# EAGLE design relay_controller (EAGLE 7.6.0)

## Sheet 1 of 2
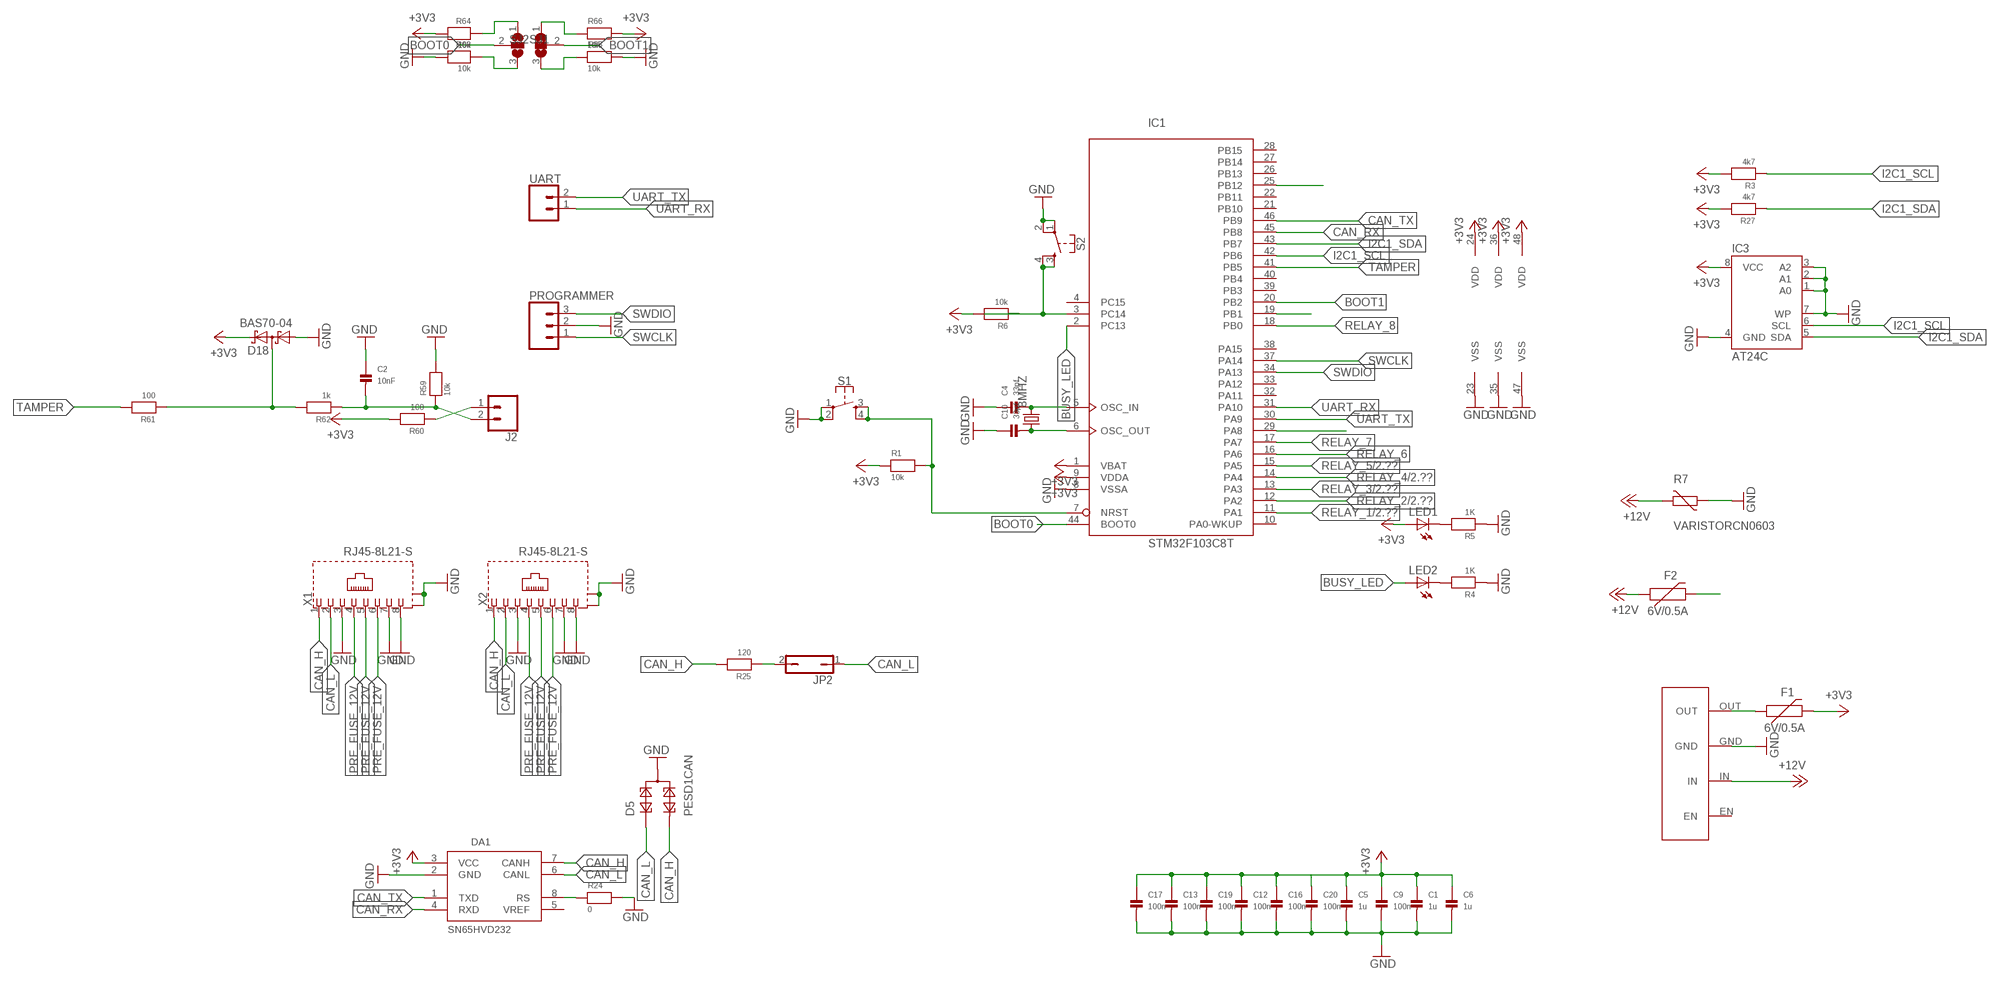
[diagram p0: schematic, sheet 1]

### Parts
8MHZ  CRYSTALHC49UP  [HC49UP]
C1  1u  CAP_CERAMIC0603  [0603]
C2  10nF  CAP_CERAMIC0603  [0603]
C4  33pf  CAP_CERAMIC0603  [0603]
C5  1u  CAP_CERAMIC0603  [0603]
C6  1u  CAP_CERAMIC0603  [0603]
C9  100n  CAP_CERAMIC0603  [0603]
C10  33pf  CAP_CERAMIC0603  [0603]
C12  100n  CAP_CERAMIC0603  [0603]
C13  100n  CAP_CERAMIC0603  [0603]
C16  100n  CAP_CERAMIC0603  [0603]
C17  100n  CAP_CERAMIC0603  [0603]
C19  100n  CAP_CERAMIC0603  [0603]
C20  100n  CAP_CERAMIC0603  [0603]
D5  PESD1CAN  [SOT23]
D18  BAS70-04  [SOT23]
DA1  SN65HVD232  [SO08]
F1  6V/0.5A  PPTC_HALF-AMP  [1206]
F2  6V/0.5A  PPTC_HALF-AMP  [1206]
IC1  STM32F103C8T  [LQFP48]
IC3  AT24C  [SOIC8]
J2  CONN_023.5MM  [SCREWTERMINAL-3.5MM-2]
JP2  JP1Q  [JP1]
LED1  LEDCHIPLED_0805  [CHIPLED_0805]
LED2  LEDCHIPLED_0805  [CHIPLED_0805]
PROGRAMMER  CONN_03LOCK  [1X03_LOCK]
R1  10k  RESISTOR0603  [0603]
R3  4k7  RESISTOR0603  [0603]
R4  1K  RESISTOR0603  [0603]
R5  1K  RESISTOR0603  [0603]
R6  10k  RESISTOR0603  [0603]
R7  VARISTORCN0603  [CT/CN0603]
R24  0  RESISTOR0603  [0603]
R25  120  RESISTOR0603  [0603]
R27  4k7  RESISTOR0603  [0603]
R59  10k  RESISTOR0603  [0603]
R60  100  RESISTOR0603  [0603]
R61  100  RESISTOR0603  [0603]
R62  1k  RESISTOR0603  [0603]
R63  10k  RESISTOR0603  [0603]
R64  10k  RESISTOR0603  [0603]
R65  10k  RESISTOR0603  [0603]
R66  10k  RESISTOR0603  [0603]
S1  MOMENTARY-SWITCH-SPST-2-SMD-4.6X2.8MM  [TACTILE_SWITCH_SMD_4.6X2.8MM]
S2  MOMENTARY-SWITCH-SPST-2-SMD-4.6X2.8MM  [TACTILE_SWITCH_SMD_4.6X2.8MM]
SJ1  SJ2W  [SJ_2]
SJ2  SJ2W  [SJ_2]
U$1  HW-613  [HW-613]
UART  CONN_02  [1X02]
X1  RJ45-8L21-S  [RJ45-SHIELD1]
X2  RJ45-8L21-S  [RJ45-SHIELD1]

### Nets
+3V3: C1.1 C5.1 C6.1 C9.1 C12.1 C13.1 C16.1 C17.1 C19.1 C20.1 D18.2(C2) DA1.3(VCC) F1.2 IC1.1(VBAT) IC1.9(VDDA) IC1.24(VDD) IC1.36(VDD) IC1.48(VDD) IC3.8(VCC) LED1.A R1.1 R3.2 R6.2 R27.2 R60.2 R64.2 R66.2
+12V: F2.1 R7.2 U$1.IN ; also sheet 2
ASDASD: D18.3(C1A2) R61.1 R62.2
BOOT0: IC1.44(BOOT0) SJ1.2
BOOT1: IC1.20(PB2) SJ2.2
BUSY_LED: IC1.2(PC13) LED2.A
CAN_H: D5.2 DA1.7(CANH) R25.2 X1.1 X2.1
CAN_L: D5.1 DA1.6(CANL) JP2.1 X1.2 X2.2
CAN_RX: DA1.4(RXD) IC1.45(PB8)
CAN_TX: DA1.1(TXD) IC1.46(PB9)
GND: C1.2 C2.1 C4.1 C5.2 C6.2 C9.2 C10.1 C12.2 C13.2 C16.2 C17.2 C19.2 C20.2 D5.3 D18.1(A1) DA1.2(GND) IC1.8(VSSA) IC1.23(VSS) IC1.35(VSS) IC1.47(VSS) IC3.1(A0) IC3.2(A1) IC3.3(A2) IC3.4(GND) IC3.7(WP) PROGRAMMER.2 R4.1 R5.1 R7.1 R24.2 R59.2 R63.2 R65.2 S1.1 S1.2 S2.1 S2.2 U$1.GND X1.3 X1.7 X1.8 X1.S1(S) X1.S2(S) X2.3 X2.7 X2.8 X2.S1(S) X2.S2(S) ; also sheet 2
I2C1_SCL: IC1.42(PB6) IC3.6(SCL) R3.1
I2C1_SDA: IC1.43(PB7) IC3.5(SDA) R27.1
N$1: 8MHZ.2 C4.2 IC1.5(OSC_IN)
N$2: 8MHZ.1 C10.2 IC1.6(OSC_OUT)
N$3: F1.1 U$1.OUT
N$5: C2.2 J2.2 R59.1 R62.1
N$6: LED1.C R5.2
N$7: IC1.3(PC14) R6.1 S2.3 S2.4
N$8: LED2.C R4.2
N$10: J2.1 R60.1
N$11: IC1.7(NRST) R1.2 S1.3 S1.4
N$12: JP2.2 R25.1
N$17: DA1.8(RS) R24.1
N$29: R66.1 SJ2.1
N$30: R64.1 SJ1.1
N$31: R65.1 SJ2.3
N$32: R63.1 SJ1.3
PRE_FUSE_12V: F2.2 X1.4 X1.5 X1.6 X2.4 X2.5 X2.6
RELAY_1: IC1.11(PA1) ; also sheet 2
RELAY_2: IC1.12(PA2) ; also sheet 2
RELAY_3: IC1.13(PA3) ; also sheet 2
RELAY_4: IC1.14(PA4) ; also sheet 2
RELAY_5: IC1.15(PA5) ; also sheet 2
RELAY_6: IC1.16(PA6)
RELAY_7: IC1.17(PA7)
RELAY_8: IC1.18(PB0)
RELAY_9: IC1.19(PB1)
RELAY_12: IC1.25(PB12)
RELAY_16: IC1.29(PA8)
SWCLK: IC1.37(PA14) PROGRAMMER.1
SWDIO: IC1.34(PA13) PROGRAMMER.3
TAMPER: IC1.41(PB5) R61.2
UART_RX: IC1.31(PA10) UART.1
UART_TX: IC1.30(PA9) UART.2
Unconnected: DA1.5(VREF) IC1.4(PC15) IC1.10(PA0-WKUP) IC1.21(PB10) IC1.22(PB11) IC1.26(PB13) IC1.27(PB14) IC1.28(PB15) IC1.32(PA11) IC1.33(PA12) IC1.38(PA15) IC1.39(PB3) IC1.40(PB4) U$1.EN

## Sheet 2 of 2
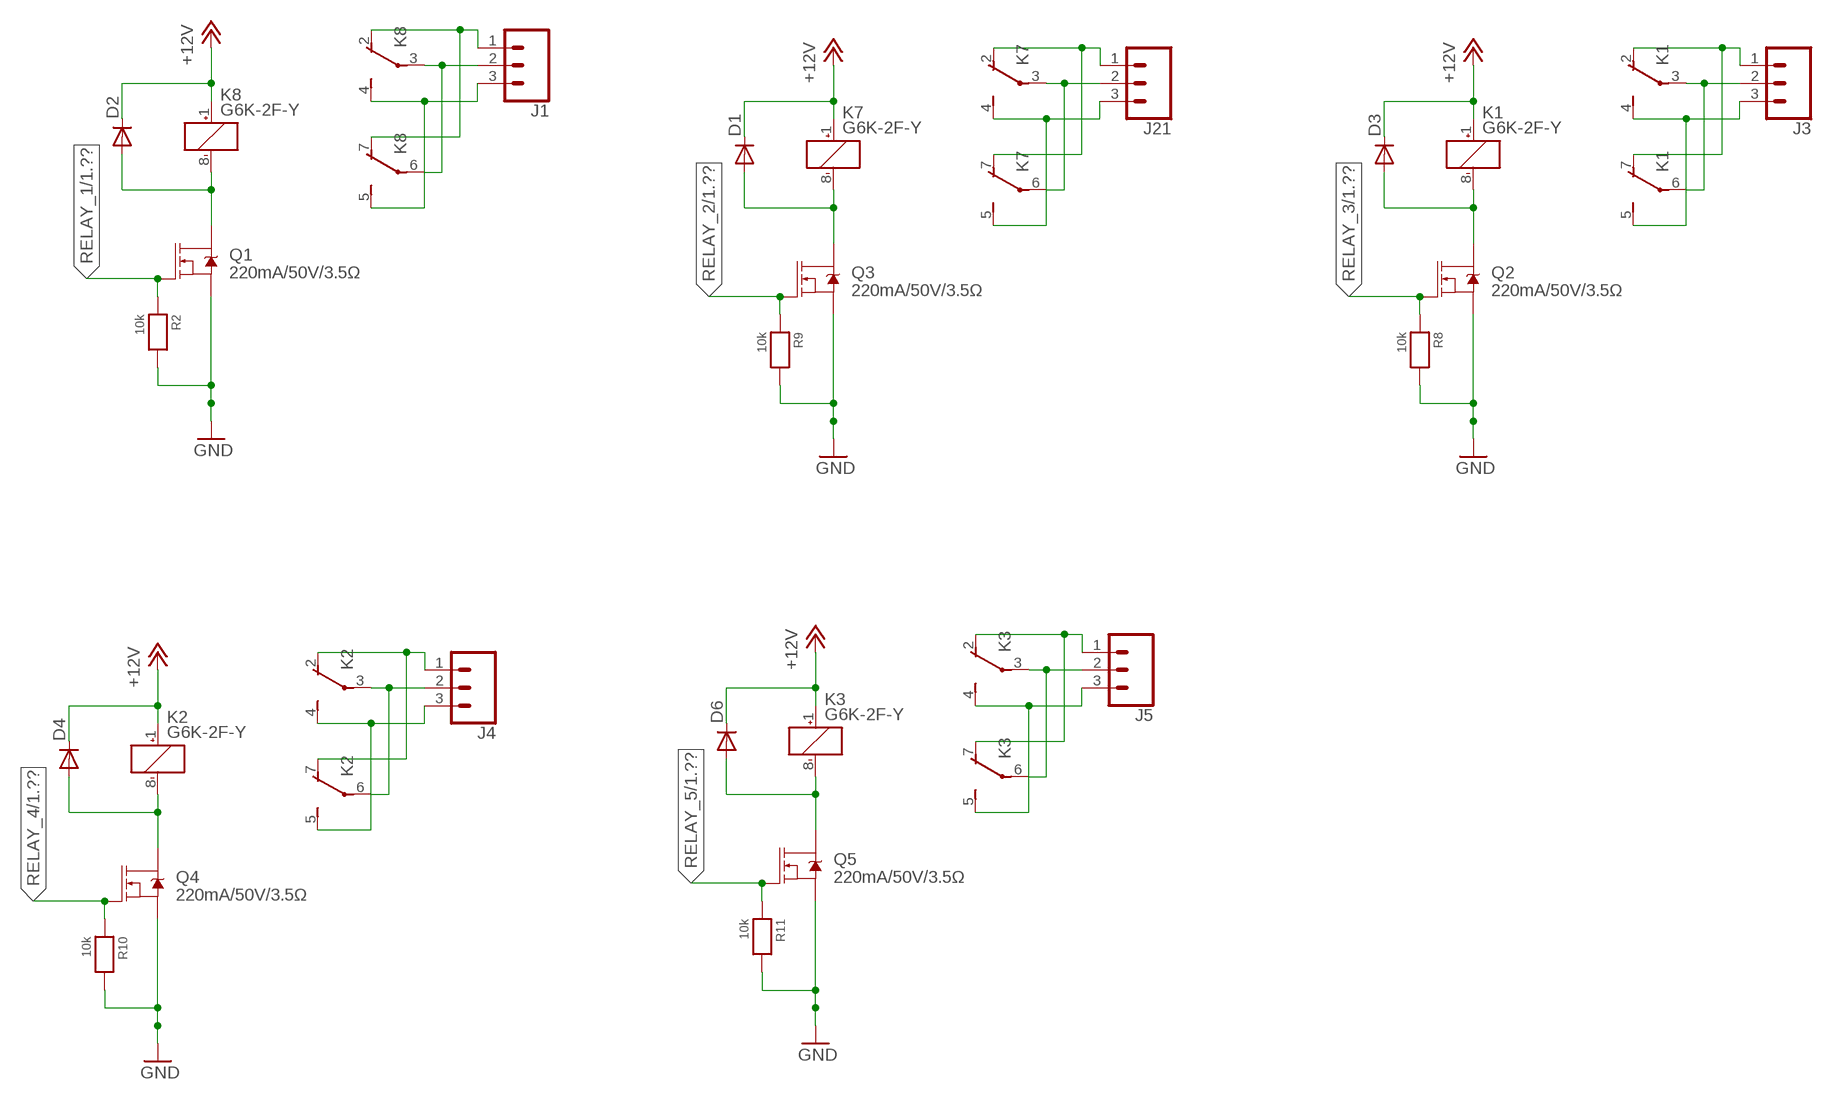
[diagram p1: schematic, sheet 2]

### Parts
D1  DIODE-DO-214AC  [DO-214AC]
D2  DIODE-DO-214AC  [DO-214AC]
D3  DIODE-DO-214AC  [DO-214AC]
D4  DIODE-DO-214AC  [DO-214AC]
D6  DIODE-DO-214AC  [DO-214AC]
J1  CONN_03SCREW  [SCREWTERMINAL-3.5MM-3]
J3  CONN_03SCREW  [SCREWTERMINAL-3.5MM-3]
J4  CONN_03SCREW  [SCREWTERMINAL-3.5MM-3]
J5  CONN_03SCREW  [SCREWTERMINAL-3.5MM-3]
J21  CONN_03SCREW  [SCREWTERMINAL-3.5MM-3]
K1  G6K-2F-Y  [G6K-2F-Y]
K2  G6K-2F-Y  [G6K-2F-Y]
K3  G6K-2F-Y  [G6K-2F-Y]
K7  G6K-2F-Y  [G6K-2F-Y]
K8  G6K-2F-Y  [G6K-2F-Y]
Q1  220mA/50V/3.5Ω  MOSFET-NCH-BSS138  [SOT23-3]
Q2  220mA/50V/3.5Ω  MOSFET-NCH-BSS138  [SOT23-3]
Q3  220mA/50V/3.5Ω  MOSFET-NCH-BSS138  [SOT23-3]
Q4  220mA/50V/3.5Ω  MOSFET-NCH-BSS138  [SOT23-3]
Q5  220mA/50V/3.5Ω  MOSFET-NCH-BSS138  [SOT23-3]
R2  10k  RESISTOR0603  [0603]
R8  10k  RESISTOR0603  [0603]
R9  10k  RESISTOR0603  [0603]
R10  10k  RESISTOR0603  [0603]
R11  10k  RESISTOR0603  [0603]

### Nets
+12V: D1.C D2.C D3.C D4.C D6.C K1.1(1:+) K2.1(1:+) K3.1(1:+) K7.1(1:+) K8.1(1:+) ; also sheet 1
GND: Q1.2(S) Q2.2(S) Q3.2(S) Q4.2(S) Q5.2(S) R2.2 R8.2 R9.2 R10.2 R11.2 ; also sheet 1
N$4: J21.1 K7.2(2:O) K7.7(3:O)
N$9: J1.1 K8.2(2:O) K8.7(3:O)
N$13: J21.3 K7.4(2:S) K7.5(3:S)
N$14: J21.2 K7.3(2:P) K7.6(3:P)
N$15: D1.A K7.8(1:-) Q3.3(D)
N$16: J1.3 K8.4(2:S) K8.5(3:S)
N$18: J1.2 K8.3(2:P) K8.6(3:P)
N$19: D2.A K8.8(1:-) Q1.3(D)
N$21: J3.1 K1.2(2:O) K1.7(3:O)
N$22: J3.3 K1.4(2:S) K1.5(3:S)
N$23: J3.2 K1.3(2:P) K1.6(3:P)
N$24: D3.A K1.8(1:-) Q2.3(D)
N$25: J4.1 K2.2(2:O) K2.7(3:O)
N$26: J4.3 K2.4(2:S) K2.5(3:S)
N$27: J4.2 K2.3(2:P) K2.6(3:P)
N$28: D4.A K2.8(1:-) Q4.3(D)
N$33: J5.1 K3.2(2:O) K3.7(3:O)
N$34: J5.3 K3.4(2:S) K3.5(3:S)
N$35: J5.2 K3.3(2:P) K3.6(3:P)
N$36: D6.A K3.8(1:-) Q5.3(D)
RELAY_1: Q1.1(G) R2.1 ; also sheet 1
RELAY_2: Q3.1(G) R9.1 ; also sheet 1
RELAY_3: Q2.1(G) R8.1 ; also sheet 1
RELAY_4: Q4.1(G) R10.1 ; also sheet 1
RELAY_5: Q5.1(G) R11.1 ; also sheet 1

## Library data of the parts
8MHZ = crystal:CRYSTAL: CRYSTAL; OC_FARNELL: unknown; OC_NEWARK: unknown
C1 C2 C4-C6 C9 C10 C12 C13 C16 C17 C19 C20 = microbuilder:CAP_CERAMIC: Ceramic Capacitors 0402 - 0402 Surface Mount Capacitors 16pF 50V 5% [Digikey: 445-4899-2-ND] 18pF 50V 5% [Digikey: 490-1281-2-ND] 22pF 50V 5% [Digikey: 490-1283-2-ND] 68pF 50V 5% [Digikey: 490-1289-2-ND] 0.1uF 10V 10% [Digikey: 490-1318-2-ND] 1.0uF 6.3V 10% [Digikey: 490-1320-2-ND] 0603 - 0603 Surface Mount Capacitors 16 pF 50V 5% [Digikey: 445-5051-2-ND] 22 pF 50V [Digikey: PCC220ACVTR-ND] 33 pF 50V 5% [Digikey: 490-1415-1-ND] 56pF 50V 5% [Digikey: 490-1421-1-ND] 220pF 50V 5% [Digikey: 445-1285-1-ND] 680 pF 50V 2200 pF 50V 5% C0G [Digikey: 445-1297-1-ND] 5600 pF 100V 5% X7R [Digikey: 478-3711-1-ND] 0.1 µF 25V 10% [Digikey: PCC2277TR-ND] 0.22 µF 16V 10% X7R [Digikey: 445-1318-1-ND] 1.0 µF 25V 10% [Digikey: 445-5146-2-ND] 0603 - RF Specific 3pF 250V +/-0.1pF RF [Digikey: 712-1347-1-ND] 18 pF 250V 5% [Digikey: 478-3505-1-ND or 712-1322-1-ND] 56 pF 250V 5% C0G RF [Digikey: 490-4867-1-ND] 68 pF 250V RF [Digikey: 490-4868-1-ND] 0805 - 0805 Surface Mount Capacitors 220 pF 250V 2% RF Ceramic Capacitor [Digikey: 712-1398-1-ND] 1000 pF 50V 2% NP0 Ceramic Capacitor [Digikey: 478-3760-1-ND] 0.1 µF 25V 10% Ceramic Capacitor [Digikey: PCC1828TR-ND] 1.0 µF 16V 10% Ceramic Capacitor[Digikey: 490-1691-2-ND] 10.0 µF 10V 10% Ceramic Capacitor[Digikey: 709-1228-1-ND] 10.0 uF 16V 10% Ceramic Capacitor [Digikey: 478-5165-2-ND] 47 uF 6.3V 20% Ceramic Capacitor [Digikey: 587-1779-1-ND or 399-5506-1-ND] 1206 - 1206 Surface Mount Capacitors 47uF 10V 20% Ceramic Capacitor [Digikey: 490-5528-1-ND or 399-5508-1-ND or 445-6010-1-ND] 100uF 6.3V -20%, +80% Y5V Ceramic Capacitor (Digikey: 490-4512-1-ND, Mouser: 81-GRM31CF50J107ZE1L)
D1-D4 D6 = diode:DIODE-: DIODE
D5 = diode:PESD1CAN: CAN bus ESD protection diode Source: http://www.nxp.com/documents/data_sheet/PESD1CAN.pdf
D18 = diode:BAS70-04: Silicon Schottky Diodes General-purpose diode for high-speed switching
DA1 = transceiver:SN65HVD232: CAN TRANSCEIVER
F1 F2 = SparkFun-Fuses:PPTC: Resettable Fuse PPTC Resettable Fuse. Really a sort of resistor with a polymeric positive temperature coefficient whose resistance increases dramatically with an increase in temperature. When heated by the power passing through the resistance rises causing the current to be limited, protecting the circuit. This is achieved by the transition of the polymer from a crystalline to an amorphous state where the conductive carbon separates breaking the conductive pathways found in the cool crystalline structure. When a PPTC cools back down it resumes conducting letting the circuit turn back on. SparkFun Products: SparkFun RedBoard - Programmed with Arduino Pro Micro - 5V/16MHz Arduino Pro 328 - 5V/16MHz MP3 Trigger; PROD_ID: RES-08585
IC1 = micro-stm:STM32F103C*T: ARM 32-bit Cortex™-M3 CPU 72 MHz maximum frequency 16 to 128 Kbytes of Flash memory 6 to 20 kbytes of SRAM 37 GPIOs 2.0 to 3.6 V application supply
IC3 = EEPROM:AT24C*: 2-wire serial EEPROM
J1 J3-J5 J21 = SparkFun-Connectors:CONN_03: Multi connection point. Often used as Generic Header-pin footprint for 0.1 inch spaced/style header connections On any of the 0.1 inch spaced packages, you can populate with these: Break Away Headers - Straight (PRT-00116) Break Away Male Headers - Right Angle (PRT-00553) Female Headers (PRT-00115) Break Away Headers - Machine Pin (PRT-00117) Break Away Female Headers - Swiss Machine Pin (PRT-00743) Stackable Header - 3 Pin (Female, 0.1") (PRT-13875) For SCREWTERMINALS and SPRING TERMINALS visit here: Screw Terimnals on SparkFun.com (5mm/3.5mm/2.54mm spacing) This device is also useful as a general connection point to wire up your design to another part of your project. Our various solder wires solder well into these plated through hole pads. Hook-Up Wire - Assortment (Stranded, 22 AWG) (PRT-11375) Hook-Up Wire - Assortment (Solid Core, 22 AWG) (PRT-11367) View the entire wire category on our website here Special notes: Molex polarized connector foot print use with SKU : PRT-08232 with associated crimp pins and housings.; PROD_ID: CONN-08288; SF_ID: PRT-08235
J2 = SparkFun-Connectors:CONN_02: Multi connection point. Often used as Generic Header-pin footprint for 0.1 inch spaced/style header connections On any of the 0.1 inch spaced packages, you can populate with these: Break Away Headers - Straight (PRT-00116) Break Away Male Headers - Right Angle (PRT-00553) Female Headers (PRT-00115) Break Away Headers - Machine Pin (PRT-00117) Break Away Female Headers - Swiss Machine Pin (PRT-00743) For SCREWTERMINALS and SPRING TERMINALS visit here: Screw Terimnals on SparkFun.com (5mm/3.5mm/2.54mm spacing) This device is also useful as a general connection point to wire up your design to another part of your project. Our various solder wires solder well into these plated through hole pads. Hook-Up Wire - Assortment (Stranded, 22 AWG) (PRT-11375) Hook-Up Wire - Assortment (Solid Core, 22 AWG) (PRT-11367) View the entire wire category on our website here Special notes: Molex polarized connector foot print use with: PRT-08233 with associated crimp pins and housings. 2.54_SCREWTERM for use with PRT-10571. 3.5mm Screw Terminal footprints for PRT-08084 5mm Screw Terminal footprints for use with PRT-08432; PROD_ID: CONN-08399
JP2 = jumper:JP1Q: JUMPER
K1-K3 K7 K8 = relay:G6K: Low Signal Relay oeiwcsnts1.omron.com/.. D20G6K0100.pdf; MF: OMRON COMPONENTS USA; MPN: G6K-2F-Y DC3; OC_FARNELL: 1690316; OC_NEWARK: 89C6451
LED1 LED2 = led:LED: LED OSRAM: - CHIPLED LG R971, LG N971, LY N971, LG Q971, LY Q971, LO R971, LY R971 LH N974, LH R974 LS Q976, LO Q976, LY Q976 LO Q996 - Hyper CHIPLED LW Q18S LB Q993, LB Q99A, LB R99A - SideLED LS A670, LO A670, LY A670, LG A670, LP A670 LB A673, LV A673, LT A673, LW A673 LH A674 LY A675 LS A676, LA A676, LO A676, LY A676, LW A676 LS A679, LY A679, LG A679 - Hyper Micro SIDELED® LS Y876, LA Y876, LO Y876, LY Y876 LT Y87S - SmartLED LW L88C, LW L88S LB L89C, LB L89S, LG L890 LS L89K, LO L89K, LY L89K LS L896, LA L896, LO L896, LY L896 - TOPLED LS T670, LO T670, LY T670, LG T670, LP T670 LSG T670, LSP T670, LSY T670, LOP T670, LYG T670 LG T671, LOG T671, LSG T671 LB T673, LV T673, LT T673, LW T673 LH T674 LS T676, LA T676, LO T676, LY T676, LB T676, LH T676, LSB T676, LW T676 LB T67C, LV T67C, LT T67C, LS T67K, LO T67K, LY T67K, LW E67C LS E67B, LA E67B, LO E67B, LY E67B, LB E67C, LV E67C, LT E67C LW T67C LS T679, LY T679, LG T679 LS T770, LO T770, LY T770, LG T770, LP T770 LB T773, LV T773, LT T773, LW T773 LH T774 LS E675, LA E675, LY E675, LS T675 LS T776, LA T776, LO T776, LY T776, LB T776 LHGB T686 LT T68C, LB T68C - Hyper Mini TOPLED® LB M676 - Mini TOPLED Santana® LG M470 LS M47K, LO M47K, LY M47K Source: http://www.osram.convergy.de LUXEON: - LUMILED® LXK2-PW12-R00, LXK2-PW12-S00, LXK2-PW14-U00, LXK2-PW14-V00 LXK2-PM12-R00, LXK2-PM12-S00, LXK2-PM14-U00 LXK2-PE12-Q00, LXK2-PE12-R00, LXK2-PE12-S00, LXK2-PE14-T00, LXK2-PE14-U00 LXK2-PB12-K00, LXK2-PB12-L00, LXK2-PB12-M00, LXK2-PB14-N00, LXK2-PB14-P00, LXK2-PB14-Q00 LXK2-PR12-L00, LXK2-PR12-M00, LXK2-PR14-Q00, LXK2-PR14-R00 LXK2-PD12-Q00, LXK2-PD12-R00, LXK2-PD12-S00 LXK2-PH12-R00, LXK2-PH12-S00 LXK2-PL12-P00, LXK2-PL12-Q00, LXK2-PL12-R00 Source: www.luxeon.com KINGBRIGHT: KA-3528ASYC Source: www.kingbright.com
PROGRAMMER = SparkFun-Connectors:CONN_03: Multi connection point. Often used as Generic Header-pin footprint for 0.1 inch spaced/style header connections On any of the 0.1 inch spaced packages, you can populate with these: Break Away Headers - Straight (PRT-00116) Break Away Male Headers - Right Angle (PRT-00553) Female Headers (PRT-00115) Break Away Headers - Machine Pin (PRT-00117) Break Away Female Headers - Swiss Machine Pin (PRT-00743) Stackable Header - 3 Pin (Female, 0.1") (PRT-13875) For SCREWTERMINALS and SPRING TERMINALS visit here: Screw Terimnals on SparkFun.com (5mm/3.5mm/2.54mm spacing) This device is also useful as a general connection point to wire up your design to another part of your project. Our various solder wires solder well into these plated through hole pads. Hook-Up Wire - Assortment (Stranded, 22 AWG) (PRT-11375) Hook-Up Wire - Assortment (Solid Core, 22 AWG) (PRT-11367) View the entire wire category on our website here Special notes: Molex polarized connector foot print use with SKU : PRT-08232 with associated crimp pins and housings.
Q1-Q5 = SparkFun-DiscreteSemi:MOSFET-NCH: N-channel MOSFETs Voltage controlled devices that allow control of high current outputs. SparkFun Products: SparkFun OpenScale <https://www.sparkfun.com/products/13261> SparkFun Digital Sandbox <https://www.sparkfun.com/products/12651> SparkFun Monster Moto Shield <https://www.sparkfun.com/products/10182> SparkFun MOSFET Power Controller <https://www.sparkfun.com/products/11214>; PROD_ID: TRANS-00830
R1-R6 R8-R11 R24 R25 R27 R59-R66 = microbuilder:RESISTOR: Resistors 0402 - 0402 Surface Mount Package 22 Ohm 1% 1/16W [Digikey: 311-22.0LRTR-ND] 33 Ohm 5% 1/16W 1.0K 5% 1/16W 1.5K 5% 1/16W 2.0K 1% 1/16W 10.0K 1% 1/16W [Digikey: 311-10.0KLRTR-ND] 10.0K 5% 1/16W [Digikey: RMCF0402JT10K0TR-ND] 12.1K 1% 1/16W [Digikey: 311-22.0LRTR-ND] 100.0K 5% 1/16W 0603 - 0603 Surface Mount Package 0 Ohm 1/10 Watt 1% Resistor 15 Ohm 1/10 Watt 1% Resistor 33 Ohm 1/10 Watt 1% Resistor 49.9 Ohm 1/10 Watt 1% Resistor 100 Ohm 1/10 Watt 1% Resistor 150 Ohm 1/10 Watt 1% Resistor 240 Ohm 1/10 Watt 1% Resistor 390 Ohm 1/10 Watt 1% Resistor 560 Ohm 1/10 Watt 1% Resistor 680 Ohm 1/10 Watt 1% Resistor 750 Ohm 1/10 Watt 1% Resistor 1.0K Ohm 1/10 Watt 1% Resistor 1.5K Ohm 1/10 Watt 1% Resistor 2.0K Ohm 1/10 Watt 1% Resistor 2.2K Ohm 1/10 Watt 1% Resistor 3.3K Ohm 1/10 Watt 1% Resistor 4.7K Ohm 1/10 Watt 1% Resistor 10.0K Ohm 1/10 Watt 1% Resistor 12.0K Ohm 1/10 Watt 1% Resistor 12.1K Ohm 1/10 Watt 1% Resistor 20.0K Ohm 1/10 Watt 1% Resistor 33.0K Ohm 1/10 Watt 1% Resistor 100.0K Ohm 1/10 Watt 1% Resistor 0805 - 0805 Surface Mount Package 0 Ohm 1/8 Watt 1% Resistor 33 Ohm 1/8 Watt 1% Resistor 100 Ohm 1/8 Watt 1% Resistor 150 Ohm 1/8 Watt 1% Resistor 200 Ohm 1/8 Watt 1% Resistor 240 Ohm 1/8 Watt 1% Resistor 330 Ohm 1/8 Watt 1% Resistor 390 Ohm 1/8 Watt 1% Resistor 470 Ohm 1/8 Watt 1% Resistor 1.0K Ohm 1/8 Watt 1% Resistor 1.5K Ohm 1/8 Watt 1% Resistor 2.0K Ohm 1/8 Watt 1% Resistor 4.7K Ohm 1/8 Watt 1% Resistor 5.1K Ohm 1/8 Watt 1% Resistor 5.6K Ohm 1/8 Watt 1% Resistor 10.0K Ohm 1/8 Watt 1% Resistor 22.0K Ohm 1/8 Watt 1% Resistor 33.0K Ohm 1/8 Watt 1% Resistor 100K Ohm 1/8 Watt 1% Resistor 1206 - 1206 Surface Mount Package 2012 - 2010 Surface Mount Package 0.11 Ohm 1/2 Watt 1% Resistor - Digikey: RHM.11UCT-ND
R7 = varistor:VARISTOR: VARISTOR
S1 S2 = SparkFun-Switches:MOMENTARY-SWITCH-SPST-2: Momentary Switch (Pushbutton) - SPST - Two Circuits Normally-open (NO) SPST momentary switches (buttons, pushbuttons). Schematic symbol includes two switch circuits. Variants SMD-4.6MMX2.8MM - 4.60mm x 2.80mm Tactile Momentary Button Switch - Used on SparkFun SAMD21 Mini Breakout SMD-5.2MM - Mini Pushbutton Switch - SMD - Used on Arduino Pro Mini; PROD_ID: SWCH-13065
SJ1 SJ2 = jumper:SJ2W: SMD solder JUMPER
U$1 = components:HW-613
UART = SparkFun-Connectors:CONN_02: Multi connection point. Often used as Generic Header-pin footprint for 0.1 inch spaced/style header connections On any of the 0.1 inch spaced packages, you can populate with these: Break Away Headers - Straight (PRT-00116) Break Away Male Headers - Right Angle (PRT-00553) Female Headers (PRT-00115) Break Away Headers - Machine Pin (PRT-00117) Break Away Female Headers - Swiss Machine Pin (PRT-00743) For SCREWTERMINALS and SPRING TERMINALS visit here: Screw Terimnals on SparkFun.com (5mm/3.5mm/2.54mm spacing) This device is also useful as a general connection point to wire up your design to another part of your project. Our various solder wires solder well into these plated through hole pads. Hook-Up Wire - Assortment (Stranded, 22 AWG) (PRT-11375) Hook-Up Wire - Assortment (Solid Core, 22 AWG) (PRT-11367) View the entire wire category on our website here Special notes: Molex polarized connector foot print use with: PRT-08233 with associated crimp pins and housings. 2.54_SCREWTERM for use with PRT-10571. 3.5mm Screw Terminal footprints for PRT-08084 5mm Screw Terminal footprints for use with PRT-08432
X1 X2 = con-tycoelectronics:RJ45*2: RJ45 Low Profile Shield Type 2 For all RJ45 L, LC, LCT and X Series Models Source: www.tycoelectronics.com .. ENG_DS_1654001_1099_RJ_L_0507.pdf; OC_FARNELL: unknown; OC_NEWARK: unknown

## Board
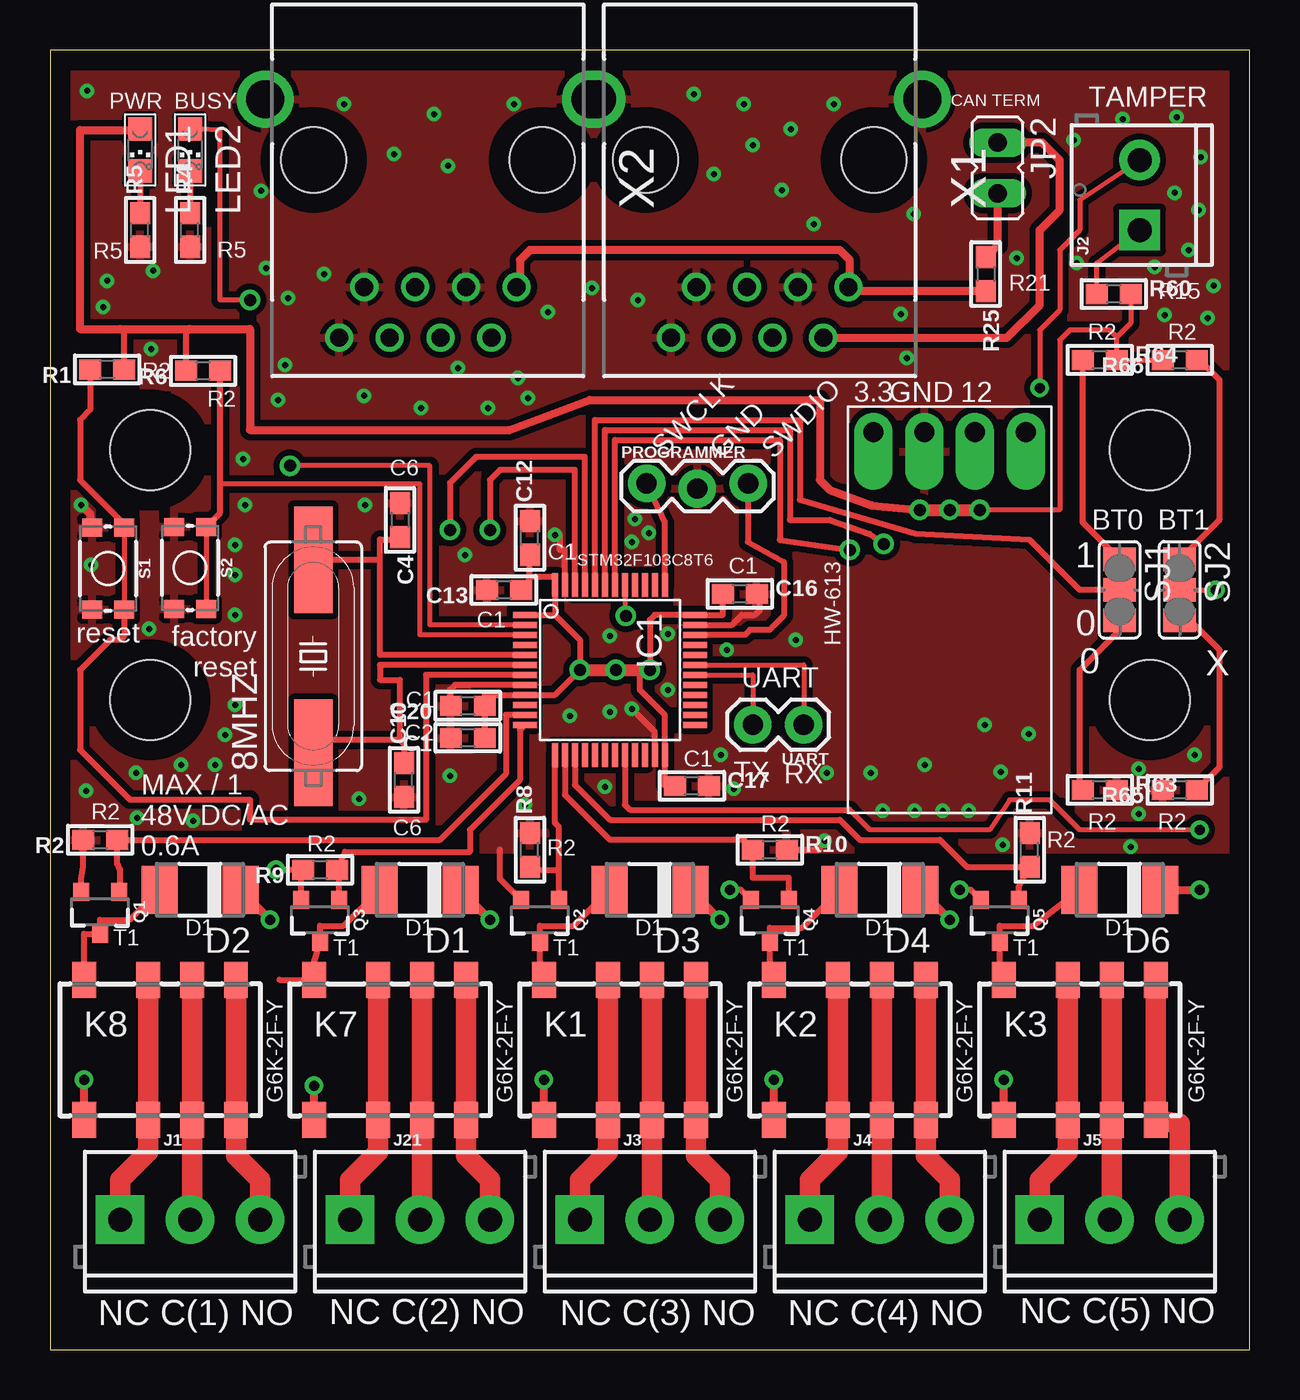
[diagram p2: board, top side]
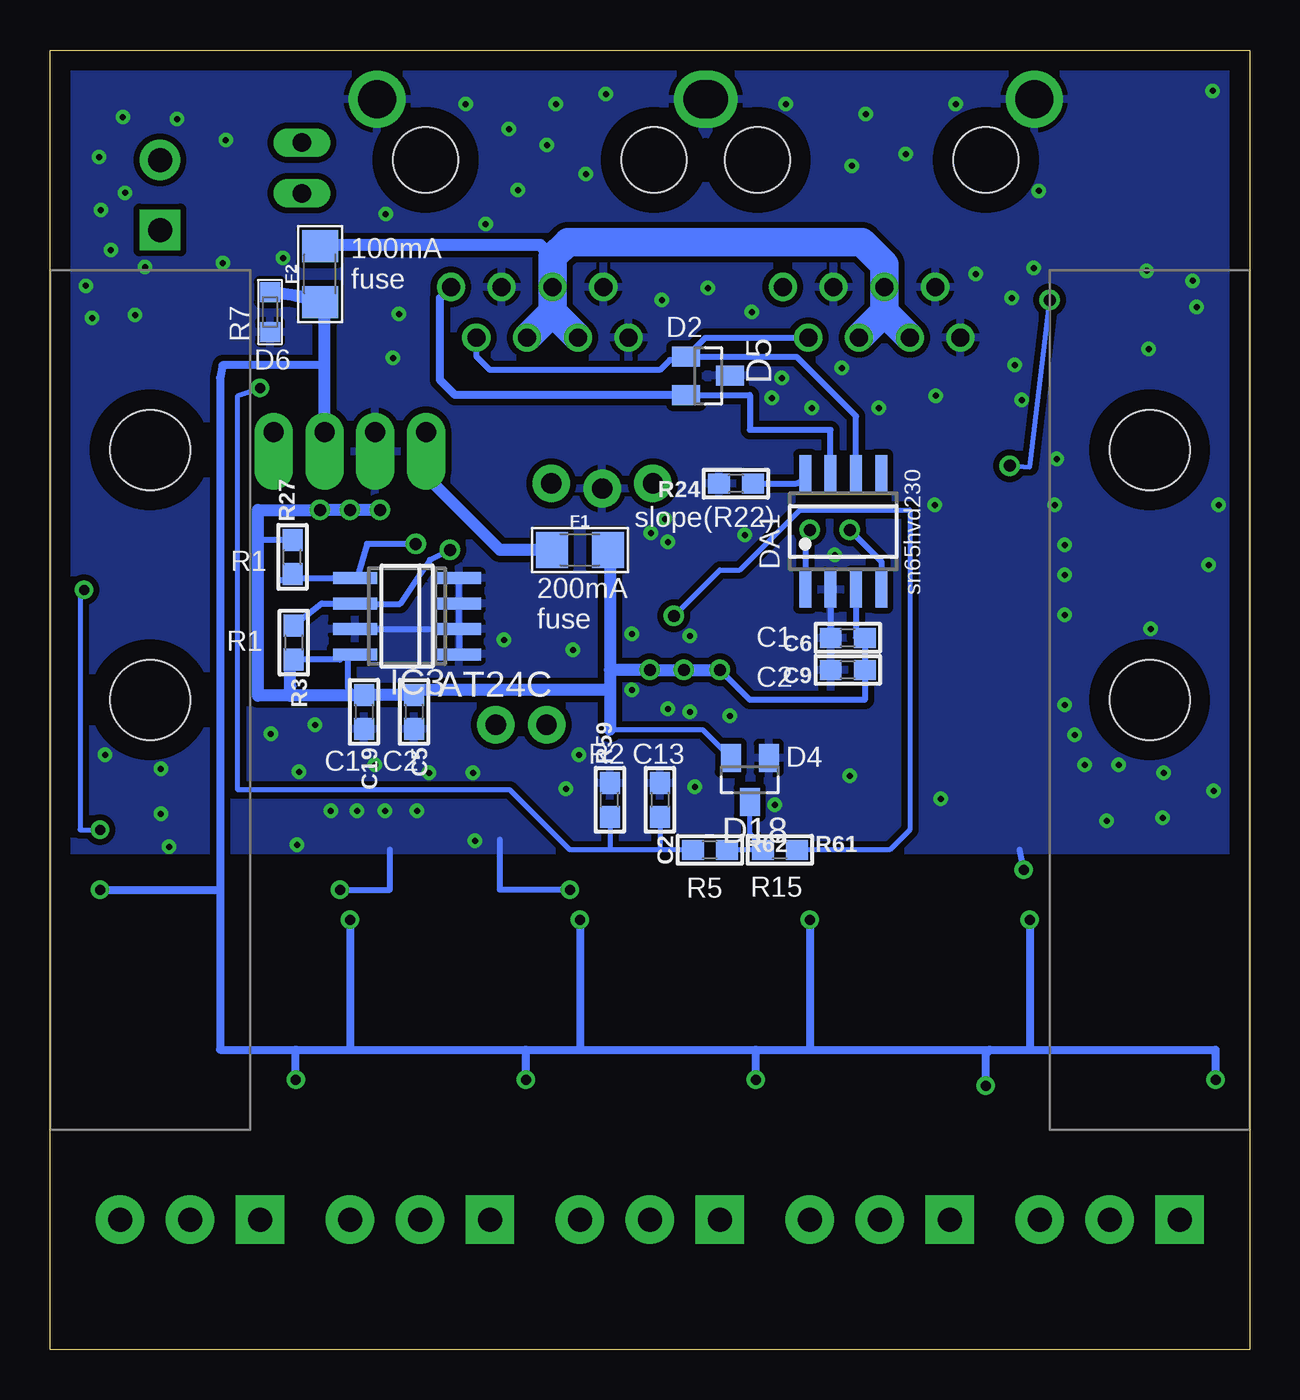
[diagram p3: board, bottom side, seen from below]

Size 60 x 65 mm. Coordinates in mm from the lower left corner, seen from the top.
Outline: 0,0 60,0 60,65 0,65 0,0
Copper layers (1*16): Top 0.035mm / dielectric 1.5mm / Bottom 0.035mm
Design rules "default *": minimum track width 10mil, minimum drill 0.3mm, track to track 6mil, track to pad 6mil, pad to pad 6mil, via to via 6mil, smd to smd 6mil, copper to edge 40mil, drill to drill 8mil, minimum pad ring 10mil, minimum via ring 8mil, stop-mask expansion 4mil, vias tented up to drill 0mil, thermal gap 10mil

### Footprints (pad centres in the part's own frame; a part is rotated, then mirrored left to right if it is on the bottom)
HC49UP = smd 5.334 x 1.93: 1 -4.826,0; 2 4.826,0
0603 = smd 1.1 x 1: 1 -0.85,0; 2 0.85,0
DO-214AC = smd 1.8 x 2.4: A 2.025,0; C -2.025,0
SOT23 = smd 1 x 1.4: 1 -0.95,-1.1; 2 0.95,-1.1; 3 0,1.1
SO08 = smd 0.6 x 1.8: 1 -1.905,-2.917; 2 -0.635,-2.917; 3 0.635,-2.917; 4 1.905,-2.917; 5 1.905,2.917; 6 0.635,2.917; 7 -0.635,2.917; 8 -1.905,2.917
1206 = smd 1.6 x 1.8: 1 -1.4,0; 2 1.4,0
LQFP48 = smd 0.3 x 1.2: 1 -2.75,-4.25; 2 -2.25,-4.25; 3 -1.75,-4.25; 4 -1.25,-4.25; 5 -0.75,-4.25; 6 -0.25,-4.25; 7 0.25,-4.25; 8 0.75,-4.25; 9 1.25,-4.25; 10 1.75,-4.25; 11 2.25,-4.25; 12 2.75,-4.25; 25 2.75,4.25; 26 2.25,4.25; 27 1.75,4.25; 28 1.25,4.25; 29 0.75,4.25; 30 0.25,4.25; 31 -0.25,4.25; 32 -0.75,4.25; 33 -1.25,4.25; 34 -1.75,4.25; 35 -2.25,4.25; 36 -2.75,4.25 | smd 1.2 x 0.3: 13 4.25,-2.75; 14 4.25,-2.25; 15 4.25,-1.75; 16 4.25,-1.25; 17 4.25,-0.75; 18 4.25,-0.25; 19 4.25,0.25; 20 4.25,0.75; 21 4.25,1.25; 22 4.25,1.75; 23 4.25,2.25; 24 4.25,2.75; 37 -4.25,2.75; 38 -4.25,2.25; 39 -4.25,1.75; 40 -4.25,1.25; 41 -4.25,0.75; 42 -4.25,0.25; 43 -4.25,-0.25; 44 -4.25,-0.75; 45 -4.25,-1.25; 46 -4.25,-1.75; 47 -4.25,-2.25; 48 -4.25,-2.75
SOIC8 = smd 0.6 x 2.2: 1 -1.905,-2.6; 2 -0.635,-2.6; 3 0.635,-2.6; 4 1.905,-2.6; 5 1.905,2.6; 6 0.635,2.6; 7 -0.635,2.6; 8 -1.905,2.6
SCREWTERMINAL-3.5MM-3 = drill 1.2 pad 2.413 square: 1 0,0 | drill 1.2 pad 2.413: 2 3.5,0; 3 7,0
SCREWTERMINAL-3.5MM-2 = drill 1.2 pad 2.032 square: 1 0,0 | drill 1.2 pad 2.032: 2 3.5,0
JP1 = drill 0.914 long: 1 0,-1.27; 2 0,1.27
G6K-2F-Y = smd 1.2 x 1.8: 1 -3.8,-3.5; 2 -0.6,-3.5; 3 1.6,-3.5; 4 3.8,-3.5; 5 3.8,3.5; 6 1.6,3.5; 7 -0.6,3.5; 8 -3.8,3.5
CHIPLED_0805 = smd 1.2 x 1.2: A 0,-1.05; C 0,1.05
1X03_LOCK = drill 1.016 pad 1.88: 1 0,0.127; 2 2.54,-0.127; 3 5.08,0.127
SOT23-3 = smd 0.8 x 0.9: 1 -0.95,-1; 2 0.95,-1; 3 0,1.1
CT/CN0603 = smd 1 x 1: 1 -1,0; 2 1,0
TACTILE_SWITCH_SMD_4.6X2.8MM = smd 0.9 x 1: 1 -2.05,-0.8; 2 2.05,-0.8; 3 2.05,0.8; 4 -2.05,0.8
SJ_2 = smd 1.168 x 1.6: 1 -1.524,0; 2 0,0; 3 1.524,0
HW-613 = drill 1 pad 1.93 offset: EN -8.89,3.81; GND -8.89,-1.27; IN -8.89,1.27; OUT -8.89,-3.81
C45-DIN-MOUNT-2-HOLE-B = hole 4: 0,12.5; 0,0
1X02 = drill 1.016 pad 1.88: 1 0,0; 2 2.54,0
RJ45-SHIELD1 = drill 0.9 pad 1.4: 1 -4.445,6.35; 2 -3.175,8.89; 3 -1.905,6.35; 4 -0.635,8.89; 5 0.635,6.35; 6 1.905,8.89; 7 3.175,6.35; 8 4.445,8.89 | drill 1.9 pad 2.5: S1 -8.128,-3.048; S2 8.128,-3.048 | hole 3.251: -5.715,0; 5.715,0

### Placement (x,y rotation side)
8MHZ  13.17,34.67 90 top
C1  20.9,30.6 180 top
C2  29.5,27.5 270 bottom
C4  17.5,41.5 270 top
C5  41.8,31.9 270 bottom
C6  20.1,35.6 180 bottom
C9  20.1,34 180 bottom
C10  17.7,28.5 90 top
C12  24,40.6 90 top
C13  22.7,38 180 top
C16  34.5,37.8 0 top
C17  32.1,28.2 0 top
C19  44.3,31.9 270 bottom
C20  20.9,32.2 180 top
D1  18.5,23 180 top
D2  7.5,23 180 top
D3  30,23 180 top
D4  41.5,23 180 top
D5  27.08,48.7 270 bottom
D6  53.5,23 180 top
D18  25,28.5 180 bottom
DA1  20.32,40.92 0 bottom
F1  33.5,40 0 bottom
F2  46.5,53.8 90 bottom
IC1  28,34 270 top
IC3  42.14,36.68 90 bottom
J1  3.5,6.5 0 top
J2  54.5,56 90 top
J3  26.5,6.5 0 top
J4  38,6.5 0 top
J5  49.5,6.5 0 top
J21  15,6.5 0 top
JP2  47.4,59.1 180 top
K1  28.5,15 0 top
K2  40,15 0 top
K3  51.5,15 0 top
K7  17,15 0 top
K8  5.5,15 0 top
LED1  4.5,60 180 top
LED2  7,60 180 top
PROGRAMMER  29.84,43.19 0 top
Q1  2.5,21.9 180 top
Q2  24.5,21.5 180 top
Q3  13.5,21.5 180 top
Q4  36,21.5 180 top
Q5  47.5,21.5 180 top
R1  2.86,49.02 180 top
R2  2.5,25.5 180 top
R3  47.81,35.36 270 bottom
R4  7,56 90 top
R5  4.5,56 90 top
R6  7.65,48.95 180 top
R7  49,51.9 90 bottom
R8  24,25 90 top
R9  13.5,24 180 top
R10  36,25 0 top
R11  49,25 90 top
R24  25.69,43.31 180 bottom
R25  46.8,53.8 270 top
R27  47.87,39.64 90 bottom
R59  32,27.5 90 bottom
R60  53.2,52.8 0 top
R61  23.5,25 0 bottom
R62  27,25 0 bottom
R63  52.5,28 0 top
R64  52.5,49.5 0 top
R65  56.5,28 180 top
R66  56.5,49.5 180 top
S1  2.9,39.06 270 top
S2  7,39.1 270 top
SJ1  53.5,38 270 top
SJ2  56.5,38 270 top
U$1  45,37 270 top
U$2  [C45-DIN-MOUNT-2-HOLE-B]  55,32.5 0 top
U$3  [C45-DIN-MOUNT-2-HOLE-B]  5,32.5 0 top
UART  37.7,31.25 180 top
X1  35.5,59.5 180 top
X2  18.9,59.5 180 top

### Tracks (layer width: path | path; a pad name or v marks a point on that pad's centre or on a via)
+3V3  (via drill 0.6)
  Top 0.254: R66.2 R64.2 53.35,50.65 | 53.35,50.65 53,51 51,51 50.5,50.5 50.5,42 v46.5,42 | R60.2 54.05,51.35 53.35,50.65
  Top 0.305: 23.95,38.65 25.25,38.65 IC1.48 25.25,36.75 | 23.54,36.75 IC1.1 25.25,36.75 | 25.25,36.75 26.5,35.5 v26.5,34 25.25,32.75 IC1.9 21.74,32.75 C20.1 | 29.5,34 29.5,33 30.75,31.75 IC1.24 30.75,28.2 C17.1 | v30,34 30,36.5 30.25,36.75 IC1.36 33.65,36.75 C16.1 | R1.1 3.71,50.84 3.5,51.05 | R6.2 6.8,50.85 7,51.05 | C13.1 23.95,38 23.95,38.65 | C12.1 23.95,39.75 23.95,38.65 | C20.1 21.75,32.36 21.73,32.38 | C1.1 C20.1
  Top 0.406: 4.5,61 1.5,61 1.5,51.05 3.5,51.05 7,51.05 10,51.05 10,46 23,46 27,47.5 38.5,47.5 38.5,43.5 39,43 41.1,42.22 v43.5,42
  Top 0.61: 4.5,61 LED1.A | v26.5,34 29.5,34 v30,34 | v43.5,42 v46.5,42
  Bottom 0.254: 45.5,34.51 45.51,34.51 | D18.2 27.35,31 32,31 | 47.8,33.21 48,32.71
  Bottom 0.305: IC3.8 45.11,34.91 | 45.11,34.91 45.51,34.51 R3.2 48,34.5 | 19.68,37.5 19.68,35.6 C6.1 C9.1 19.25,32.5 25,32.5 v26.5,34 | 42.09,33 42,33 | R27.2 49.5,40.49 49.6,40.1 | 45.11,34.91 45.11,33.11 44.5,32.5 44.5,33
  Bottom 0.406: 19.68,37.5 DA1.3
  Bottom 0.61: v26.5,34 v28.3,34 v30,34 32,34 | 32,34 32,33 | 32,33 32,31 | 32,33 42,33 42,32.95 C5.1 | v43.5,42 v45,42 v46.5,42 49.6,42 49.6,40.1 49.6,32.71 48,32.71 | F1.2 32,39.9 32,34 | 48,32.71 48,34.5 | 42.09,33 42.34,32.75 C19.1 44.34,32.71 48,32.71
+12V  (via drill 0.5)
  Top 0.406: K3.1 v47.7,13.5 | K2.1 v36.2,13.5 | K1.1 v24.7,13.5 | K7.1 v13.2,13.2 | K8.1 v1.7,13.5 | D2.C 9.53,22.98 v11,21.5 | D6.C v57.5,23 | D1.C 20.52,22.98 v22,21.5 | D3.C 32.02,22.98 v33.5,21.5 | D4.C 43.52,22.98 v45,21.5
  Bottom 0.254: 46.27,52.27 46.4,52.4 F2.1
  Bottom 0.406: 51.5,23 51.5,48.6 51.37,49.23 46.27,49.23 | 51.5,23 51.5,15 47.7,15 | 47.7,15 45,15 | 45,15 36.2,15 | 36.2,15 33.5,15 | 33.5,15 24.7,15 | 24.7,15 22,15 | 22,15 13,15 | 13,15 11,15 | 11,15 1.7,15 v1.7,13.5 | v47.7,13.5 47.7,15 | v36.2,13.5 36.2,15 | v24.7,13.5 24.7,15 | v13.2,13.2 13.2,14.8 13,15 | v11,21.5 11,15 | v57.5,23 51.5,23 | v22,21.5 22,15 | v33.5,21.5 33.5,15 | v45,21.5 45,15
  Bottom 0.61: U$1.IN 46.27,49.23 46.27,52.27 | F2.1 47.7,52.7 R7.2
ASDASD
  Bottom 0.254: R62.2 R61.1 25,25.85 D18.3
BOOT0
  Top 0.305: IC1.44 27.25,46.5 37.5,46.5 37.5,42.5 43.3,40.8 49,40.5 51.5,38 SJ1.2
BOOT1  (via drill 0.5)
  Top 0.254: SJ2.2 v58.3,38 | v57.5,26 51.5,26 50,27.5 48,27.5 47,26 41,26 40,27
  Top 0.305: IC1.20 28.75,27.25 29,27 40,27
  Bottom 0.254: v58.3,38 58.5,38 58.5,26 v57.5,26
BUSY_LED  (via drill 0.6)
  Top 0.254: IC1.2 19,36.25 19,44.2 v12,44.2 | v10,52.5 8.5,52.5 8.5,61 7.45,61.05 LED2.A
  Bottom 0.254: v12,44.2 11,44.15 v10,52.5
CAN_H
  Top 0.406: X2.1 23.5,53.3 23.5,54.5 24,55 39.5,55 40,54.5 40,53.2 X1.1 40.15,52.95 R25.2
  Bottom 0.305: DA1.7 20.95,46 25,46 25,47.75 D5.2
  Bottom 0.406: D5.2 39.75,47.75 40.5,48.5 40.5,52.59 X1.1
CAN_L
  Top 0.406: X1.2 47.86,50.61 49.5,52.25 49.5,56 50.5,57 50.5,59.5 49.63,60.37 JP2.1
  Bottom 0.305: D5.1 22.65,49.65 19.68,46.69 DA1.6 | D5.1 27.22,50.61 X2.2 | D5.1 28.33,49.5 29,49.5 29.5,49 38,49 38.67,49.67 X1.2
CAN_RX  (via drill 0.6)
  Top 0.305: IC1.45 26.75,44.65 21.3,44.65 20,43.35 v20,41
  Bottom 0.305: v20,41 18.41,39.41 DA1.4
CAN_TX  (via drill 0.6)
  Top 0.305: IC1.46 26.25,44 22.5,44 22,43.5 v22,41
  Bottom 0.305: v22,41 arc-90 22.23,40.77 DA1.1
GND  (via drill 0.3, 0.5)
  Top 0.305: IC1.8 20.25,33.25 20,33 20,32.42 20.05,32.37 C20.2 | IC1.35 34.1,36.25 34.6,36.75 35.25,36.75 35.5,37 35.5,37.68 | IC1.47 25.75,40 25.5,40 25.5,40.75 v25.25,40.75 | IC1.23 30.25,30.9 v29.1,32.05 | Q3.2 12.55,24 R9.2 v11.3,24 | Q2.2 22.5,23.55 22.5,25 | Q4.2 34.55,23 v34,23 | Q5.2 46.05,23 v45.5,23 | Q1.2 1.55,23.55 1.65,24.15 R2.2 | R10.2 38.5,25 38.5,25.5
  Top 0.406: v1.55,42.25 2,41.8 2,41.5
  Bottom 0.305: IC3.7 IC3.2 | IC3.2 IC3.1 | IC3.2 IC3.3 IC3.4 | DA1.2 20.95,35.24 | v34,23 37.5,23 37.5,25.5 | v45.5,23 43,23 43,25 | v11.3,24 11.5,25
  other vias: 26,31.7 28,31.9 11.4,47.5 33.85,35 28,35.7 30.9,35.8 30.9,33 29.1,40.4 9.75,42.25 5.15,53.95 15.75,42.25 20,28.7 15.45,27.55 20.75,39.75 2.85,53.45 9.25,38.75 9.25,36.75 9.65,44.55 8.25,29.25 7.15,26.45 23.75,27.25 1.85,62.95 5.05,50.05 11.9,52.6 17.2,59.8 10.55,57.95 11.75,49.25 35.15,60.25 37.05,61.05 39.2,62.3 48.35,54.6 57.25,29.75 57.45,57 56.25,57.85 55.75,51.75 38.85,28.85 33.55,29.75 37.3,35.5 46.75,31.25 34.2,28.05 54.45,29.05 29.25,41.55 29.95,40.85 18.55,47.1 21.9,47.1 4.3,28.85 9.25,40.25 1.8,27.95 4.35,26.6 54.45,26.8 51.35,54.35 57.55,59.65 55.25,54.15 56.95,55 34.7,62.3 58.2,53.2 57.9,51.6 47.65,25.25 54.05,25.15 27.75,28.15 6.55,29.25 2.65,52.15 9.25,32.25 4.95,36.05 8.75,30.75 23.2,62.3 19.2,61.8 14.7,62.3 10.8,54.1 24.9,51.9 13.7,53.8 15.7,47.7 20.4,49.1 19.9,59.2 27.1,53.1 32.2,62.8 36.6,58 51.2,60.5 29.4,52.5 56.35,61.65 53.65,61.55 43.2,56.8 38.2,56.3 33.2,58.8 42.55,51.8 42.85,49.6 48.95,30.8 47.55,28.9 23.9,47.6 23.4,48.6 38.75,25.45 41.05,28.85 43.75,29.25 41.65,26.95 43.25,26.95 45.95,26.95 44.65,26.95 2.05,39.25
  pour Top (isolate 0.305): 0,65 60,65 60,25 0,25
  pour Bottom (isolate 0.305): 0,65 60,65 60,25 0,25
I2C1_SCL  (via drill 0.6)
  Top 0.305: IC1.42 28.25,45.5 36.5,45.5 36.5,40.5 v40,40
  Bottom 0.305: R3.1 46.41,37.31 IC3.6 42.5,37.3 41.5,38.8 41,39.5 v40,40
I2C1_SDA  (via drill 0.6)
  Top 0.305: IC1.43 27.75,46 37,46 37,41.5 39,41.5 41,40.8 v41.7,40.3
  Bottom 0.305: 48.5,38.5 48.36,38.5 R27.1 47.77,38.59 IC3.5 44.64,38.59 44.14,40.3 v41.7,40.3
N$1
  Top 0.305: IC1.5 16.5,34.75 16.5,39.5 | 16.5,39.5 8MHZ.2 | 16.5,39.5 16.5,40.52 17.37,40.52 C4.2
N$2
  Top 0.305: IC1.6 16.5,34.25 16.5,33.5 17.5,33.5 17.5,30.5 | 13.17,31.5 13.17,30.5 | 13.17,30.5 8MHZ.1 | 17.5,29.55 C10.2 17.7,30.3 17.5,30.5 | 17.5,30.5 13.17,30.5
N$3
  Bottom 0.61: F1.1 37.5,40 41.19,43.69 U$1.OUT
N$4
  Top 1.016: 15.5,6 J21.1 15,8.5 16.4,9.9 K7.2 K7.7
N$5  (via drill 0.5)
  Top 0.254: J2.2 51.5,57.5 51.5,56 50.5,55 50.5,52 49.5,51 v49.5,48.1
  Bottom 0.254: R62.1 29.5,25 | 29.5,25 32,25 | R59.1 32,25 | 32,25 34,25 37,28 50.6,28 50.6,47.7 v49.5,48.1 | C2.2 29.5,25
N$6
  Top 0.305: LED1.C R5.2
N$7
  Top 0.254: IC1.3 18.5,35.75 18.5,43.3 8.5,43.3 8.5,43 | S2.4 S2.3
  Top 0.305: S2.4 8.5,41.85 8.5,43 R6.1
N$8
  Top 0.305: LED2.C R4.2
N$9
  Top 1.016: K8.7 K8.2 4.9,9.9 3.5,8.5 J1.1
N$10
  Top 0.254: R60.1 52.35,54.35 J2.1
N$11
  Top 0.254: S1.4 S1.3
  Top 0.305: IC1.7 18.8,33.75 18.8,26.5 10,26.5 10,27.51 3.99,27.51 1.5,30 1.5,34 3,35.5 3.5,35.5 3.7,35.7 S1.3 | R1.2 2.01,47.01 1.5,46.5 1.5,43.5 3.7,41.3 S1.4
N$12
  Top 0.406: R25.1 47.4,55.25 JP2.2
N$13
  Top 1.016: J21.3 22,8.5 20.8,9.7 K7.4 K7.5
N$14
  Top 1.016: J21.2 18.6,6.6 K7.3 K7.6
N$15
  Top 0.305: 11.47,18.5 K7.8 13,18.7 Q3.3 13.5,21.2 14.68,21.2 D1.A
N$16
  Top 1.016: K8.5 K8.4 9.3,9.7 10.5,8.5 J1.3
N$17
  Bottom 0.305: R24.1 22.75,43.31 arc-90 DA1.8
N$18
  Top 1.016: K8.6 7.1,12 K8.3 7.1,6.6 arc-90 J1.2
N$19
  Top 0.305: K8.8 1.7,20.8 Q1.3 2.5,21.5 3.98,21.5 D2.A
N$21
  Top 1.016: J3.1 26.5,8.5 27.9,9.9 K1.2 K1.7
N$22
  Top 1.016: J3.3 33.5,8.5 32.3,9.7 K1.4 K1.5
N$23
  Top 1.016: J3.2 30.1,6.6 K1.3 K1.6
N$24
  Top 0.305: K1.8 24.5,18.7 Q2.3 24.5,21.2 26.18,21.2 D3.A
N$25
  Top 1.016: K2.7 K2.2 39.4,9.9 38,8.5 J4.1
N$26
  Top 1.016: K2.5 43.8,12 K2.4 43.8,9.7 45,8.5 J4.3
N$27
  Top 1.016: K2.6 K2.3 41.6,6.6 arc-90 J4.2
N$28
  Top 0.305: K2.8 36,18.7 Q4.3 36,21.1 37.6,21.1 39,22.5 39,22.52 D4.A
N$29
  Top 0.305: SJ2.1 58.5,41.52 58.5,48.5 57.5,49.5 R66.1
N$30
  Top 0.305: SJ1.1 51.65,41.37 R64.1
N$31
  Top 0.305: R65.1 58.5,29.15 58.5,35 57.02,36.48 SJ2.3
N$32
  Top 0.305: R63.1 51.5,28.15 51.5,34 53.5,36 SJ1.3
N$33
  Top 1.016: K3.2 50.9,12 | K3.2 50.9,9.9 49.5,8.5 J5.1 | K3.7 K3.2
N$34
  Top 1.016: J5.3 56.5,11.3 K3.4 K3.5
N$35
  Top 1.016: 53.1,6.4 K3.3 K3.6 | 53.1,6.4 53.5,6 | 53.1,6.4 J5.2
N$36
  Top 0.305: K3.8 47.5,18.7 Q5.3 47.5,21.2 49.17,21.2 D6.A
PRE_FUSE_12V
  Bottom 0.61: 34.87,54.63 35.48,55.25 46.35,55.25 F2.2
  Bottom 1.422: X2.6 18.27,51.88 | X2.4 18.27,51.88 | 18.27,51.88 X2.5 18.27,54.27 19.4,55.4 34.1,55.4 34.87,54.63 X1.5 34.87,51.88 | X1.6 34.87,51.88 | X1.4 34.87,51.88
RELAY_1
  Top 0.305: IC1.11 22.8,31.75 22.8,28.8 19.5,25.5 R2.1 3.35,24.35 3.5,24 3.5,22.9 Q1.1
RELAY_2
  Top 0.305: IC1.12 23.5,31 23.5,28.5 21,26 21,24.9 14.75,24.9 R9.1 14.45,24 Q3.1
RELAY_3
  Top 0.305: Q2.1 25.45,24 | 25.45,24 25.45,26.15 25.25,26.35 IC1.13 | R8.1 24,24 25.45,24
RELAY_4
  Top 0.305: IC1.14 25.75,27.75 28,25.5 34.7,25.5 R10.1 35.15,23.6 36.95,23.6 Q4.1
RELAY_5
  Top 0.305: Q5.1 48.45,23.15 R11.1 45.85,24.15 44.5,25.5 40.5,25.5 39.5,26.5 28,26.5 26.25,28.25 IC1.15
SWCLK
  Top 0.305: IC1.37 30.75,41.33 PROGRAMMER.1
SWDIO
  Top 0.305: IC1.34 34.75,35.75 35,36 36,36 36.22,36.22 36.7,36.72 36.7,39.4 34.9,40.4 PROGRAMMER.3
TAMPER  (via drill 0.6)
  Top 0.254: IC1.41 28.75,36.75 v28.8,36.7
  Bottom 0.254: v28.8,36.7 26.5,39 25.5,39 22.5,42 17,42 17,26 18,25 R61.2
UART_RX
  Top 0.254: IC1.31 37.7,34.25 UART.1
UART_TX
  Top 0.254: IC1.30 35.16,33.75 UART.2

### Text on the board
_tsilk: CAN TERM | PWR | BUSY | TAMPER | R5 | R5 | R21 | R15 | R2 | R2 | R2 | GND | 12 | R2 | 3.3 | SWCLK | C6 | GND | SWDIO | BT0 | BT1 | C1 | STM32F103C8T6 | C1 | 1 | C1 | 0 | reset | HW-613 | factory / reset | 0 | X | UART | C1 | C2 | C1 | TX | RX | R2 | C6 | R2 | R2 | R2 | MAX / 1 / 48V DC/AC / 0.6A | R2 | R2 | R2 | D1 | D1 | D1 | D1 | D1 | T1 | T1 | T1 | T1 | T1 | G6K-2F-Y | G6K-2F-Y | G6K-2F-Y | G6K-2F-Y | G6K-2F-Y | NC C(1) NO | NC C(2) NO | NC C(3) NO | NC C(4) NO | NC C(5) NO
_bsilk: 100mA / fuse | D2 | D6 | slope(R22) | R1 | sn65hvd230 | C1 | 200mA / fuse | R1 | C2 | AT24C | D4 | C13 | R2 | C2 | C1 | R15 | R5
200bmp: relay controller / 2021.03.14 / v1.4